# Altium schematic sheet power_supply.SchDoc
size A4
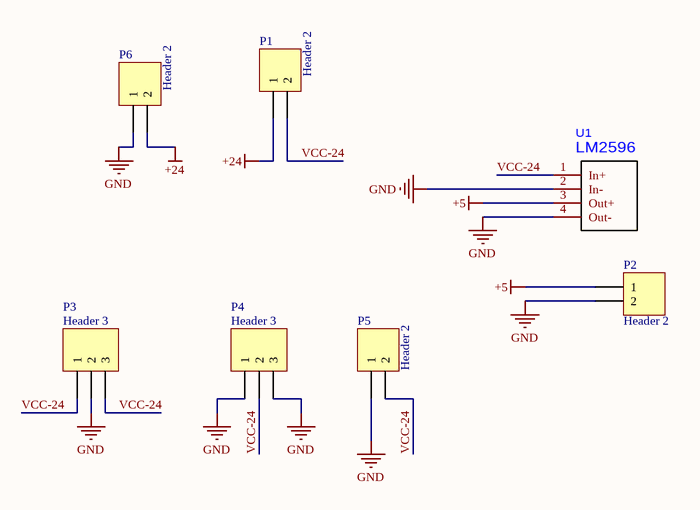
[diagram p0: power_supply.SchDoc]

## Parts
P1  Header 2  [2PIN-5.08A]
P2  Header 2  [2PIN-5.08A]
P3  Header 3  [3PIN-5.08A]
P4  Header 3  [3PIN-5.08A]
P5  Header 2  [2PIN-5.08A]
P6  Header 2  [2PIN-5.08A]
U1  (no value)  [LM2596]

## Nets
+5: P2.1 U1.3(Out+)
+24: P1.1 P6.2
GND: P2.2 P3.2 P4.1 P4.3 P5.1 P6.1 U1.2(In-) U1.4(Out-)
VCC-24: P1.2 P3.1 P3.3 P4.2 P5.2 U1.1(In+)

## Notes on the sheet
- (in symbol LM2596模块-29AH) LM2596

## Library data of the parts
P1 P2 P5 P6 = 二口插座: Header, 2-Pin; LatestRevisionDate: 17-Jul-2002; LatestRevisionNote: Re-released for DXP Platform.; Publisher: Altium Limited
P3 P4 = 三口插座: Header, 3-Pin; LatestRevisionDate: 17-Jul-2002; LatestRevisionNote: Re-released for DXP Platform.; Publisher: Altium Limited
U1 = LM2596模块-29AH